# Altium schematic sheet Conector_FPGA.SchDoc
size A4
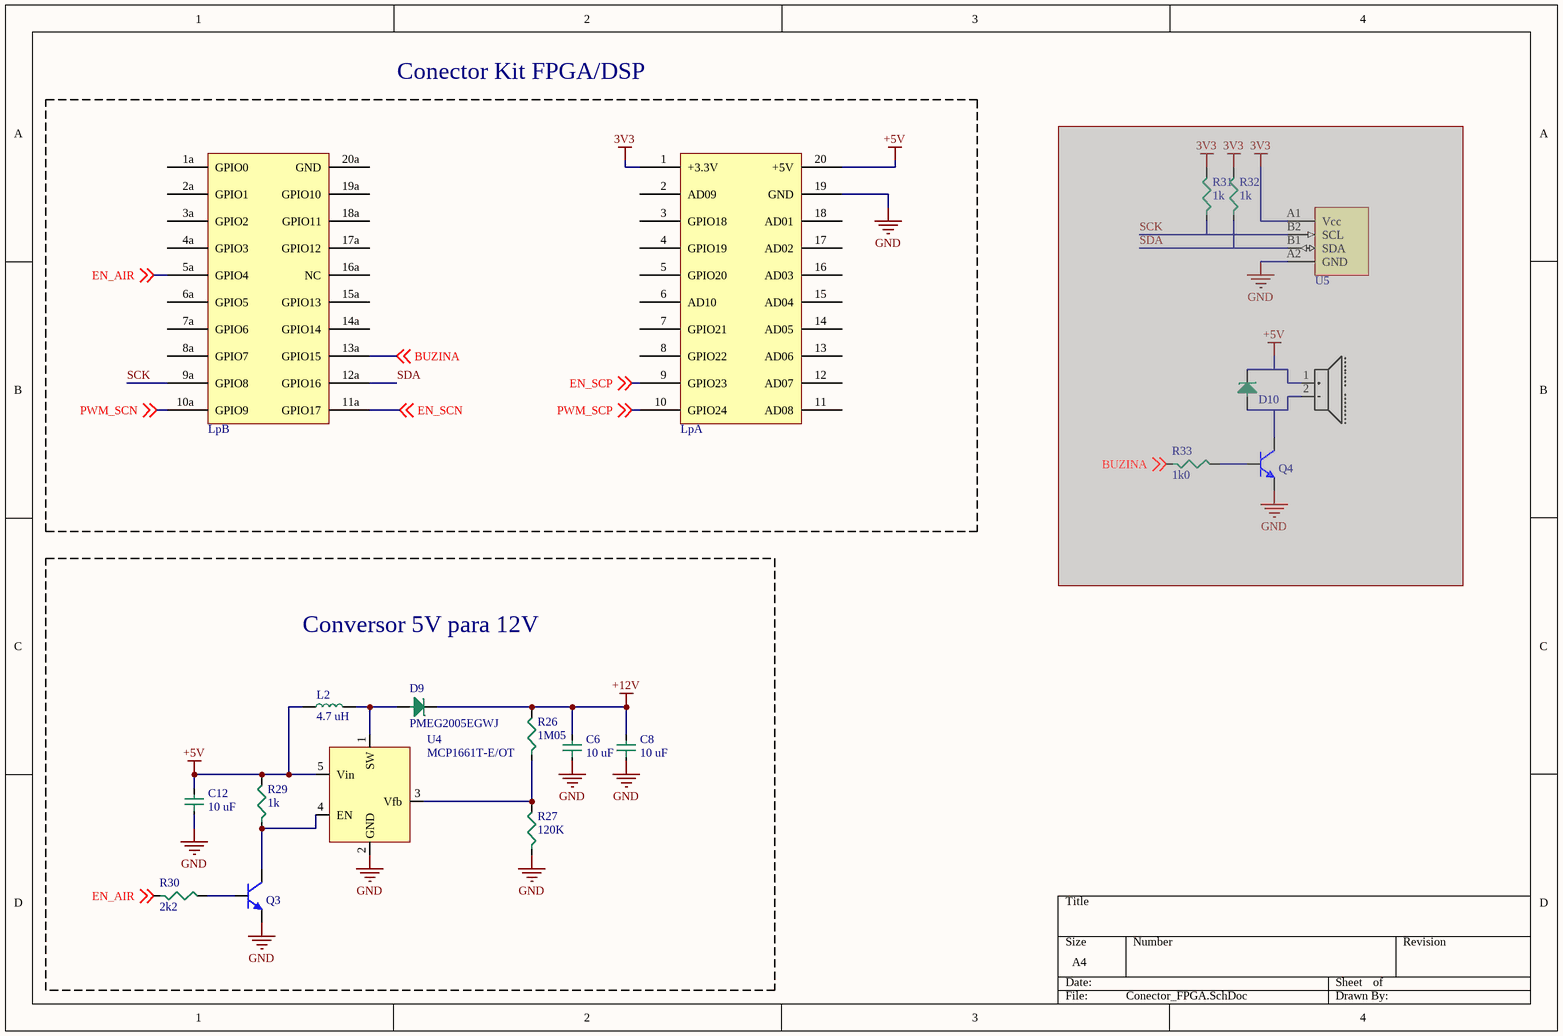
[diagram p0: Conector_FPGA.SchDoc]

## Parts
Bz1  CT-1205H-SMT-TR  [BUZZER_SMD]  (value not drawn)  (masked out: inside a compile mask, not in the netlist)
C6  value 10 uF  [0603C]  (hidden comment: 0603)
C8  value 10 uF  [0603C]  (hidden comment: 0603)
C12  value 10 uF  [0603C]  (hidden comment: 0603)
D9  PMEG2005EGWJ  [SOD-123-2]
D10  PMEG2005EGWJ  [SOD-123-2]  (value not drawn)  (masked out: inside a compile mask, not in the netlist)
L2  value 4.7 uH  [LPS5030]  (hidden comment: LPS5030-472MRB)
Lp  FPGAStartKit  [FPGA_BRUXILIS_SMD]  (value not drawn)  (parts A,B of 2)
Q3  BC-817-40  [SOT23-3N]  (value not drawn)
Q4  BC-817-40  [SOT23-3N]  (value not drawn)  (masked out: inside a compile mask, not in the netlist)
R26  value 1M05  [0603]  (hidden comment: 0603)
R27  value 120K  [0603]  (hidden comment: 0603)
R29  value 1k  [0603]  (hidden comment: 0603)
R30  value 2k2  [0603]  (hidden comment: 0603)
R31  value 1k  [0603]  (hidden comment: 0603)  (masked out: inside a compile mask, not in the netlist)
R32  value 1k  [0603]  (hidden comment: 0603)  (masked out: inside a compile mask, not in the netlist)
R33  value 1k0  [0603]  (hidden comment: 0603)  (masked out: inside a compile mask, not in the netlist)
U4  MCP1661T-E/OT  [SOT-23-5]
U5  AT30TS74-UFM14-T-072  [WLCSP-4]  (value not drawn)  (masked out: inside a compile mask, not in the netlist)

## Blocks framed on the sheet
Conector Kit FPGA/DSP: Lp
Conversor 5V para 12V: C6 C8 C12 D9 L2 Q3 R26 R27 R29 R30 U4

## Nets
3V3: Lp.1(+3.3V)
+5V: C12.2 L2.1 Lp.20(+5V) R29.2 U4.5(Vin)
+12V: C6.2 C8.2 D9.K R26.2
GND: C6.1 C8.1 C12.1 Lp.19(GND) Q3.2(E) R27.1 U4.2(GND)
BUZINA: Lp.13a(GPIO15) ; off-sheet BUZINA
EN_AIR: Lp.5a(GPIO4) R30.1 ; off-sheet EN_AIR
EN_SCN: Lp.11a(GPIO17) ; off-sheet EN_SCN
EN_SCP: Lp.9(GPIO23) ; off-sheet EN_SCP
PWM_SCN: Lp.10a(GPIO9) ; off-sheet PWM_SCN
PWM_SCP: Lp.10(GPIO24) ; off-sheet PWM_SCP
SCK: Lp.9a(GPIO8)
SDA: Lp.12a(GPIO16)
NetD9_A: D9.A L2.2 U4.1(SW)
NetQ3_1: Q3.1(B) R30.2
NetQ3_3: Q3.3(C) R29.1 U4.4(EN)
NetR26_1: R26.1 R27.2 U4.3(Vfb)

Not connected (* = marked no-connect by the designer): Lp 1a(GPIO0) 2(AD09) 2a(GPIO1) 3(GPIO18) 3a(GPIO2) 4(GPIO19) 4a(GPIO3) 5(GPIO20) 6(AD10) 6a(GPIO5) 7(GPIO21) 7a(GPIO6) 8(GPIO22) 8a(GPIO7) 11(AD08) 12(AD07) 13(AD06) 14(AD05) 14a(GPIO14) 15(AD04) 15a(GPIO13) 16(AD03) 16a(NC) 17(AD02) 17a(GPIO12) 18(AD01) 18a(GPIO11) 19a(GPIO10) 20a(GND)

## Library data of the parts
Bz1 = Buzzer SMD: Piezo Buzzers & Audio Indicators Buzzers; ComponentLink1Description: MOUSER; ComponentLink1URL: https://br.mouser.com/ProductDetail/490-CT-1205H-SMT-TR; ComponentLink2Description: DATASHEET; ComponentLink2URL: https://br.mouser.com/datasheet/2/670/ct-1205h-smt-tr-1777556.pdf
C6 C8 C12 = Capacitor SMD 0603
D9 D10 = Diodo Schottky PMEG2005: Schottky Diodes & Rectifiers SCHOTTKY DIODES; ComponentLink1Description: MOUSER; ComponentLink1URL: https://br.mouser.com/ProductDetail/841-PMEG2005EGWJ; ComponentLink2Description: DATASHEET; ComponentLink2URL: https://br.mouser.com/datasheet/2/916/PMEG6010CEGW-1599909.pdf
L2 = Indutor LPS5030-472MRB SMD: Fixed Inductors 4.7uH Shld 20% 2A 83mOhms; ComponentLink1Description: MOUSER; ComponentLink1URL: https://br.mouser.com/ProductDetail/994-LPS5030-472MRB; ComponentLink2Description: DATASHEET; ComponentLink2URL: https://br.mouser.com/datasheet/2/597/lps5030-270738.pdf
Lp = FPGAStart
Q3 Q4 = BC-817-40: NPN General Purpose Amplifier; Published: 8-Jun-2000; LatestRevisionDate: 15-Jan-2003; LatestRevisionNote: PCB Footprint 'BCY-W3/D4.7' replaced; DatasheetVersion: 1997; PackageVersion: Sep-1998; PackageReference: TO-92A; Publisher: Altium Limited; Code_JEDEC: TO-92A; ComponentLink1Description: Manufacturer Link; ComponentLink1URL: http://www.fairchildsemi.com/; ComponentLink2Description: Datasheet; ComponentLink2URL: http://www.fairchildsemi.com/ds/2N%2F2N3904.pdf
R26 R27 R29-R33 = Resistor SMD 0603 1/10 W: %: ±1%; P: 1/8W
U4 = MCP1661: Switching Voltage Regulators 32V Output Non-synch Boost Regulator; ComponentLink1Description: datasheet; ComponentLink1URL: https://br.mouser.com/datasheet/2/268/20005315A-357524.pdf; ComponentLink2Description: mouser; ComponentLink2URL: https://br.mouser.com/ProductDetail/579-MCP1661T-E-OT
U5 = Sensor Temperatura AT30TS74: Board Mount Temperature Sensors 4Ch, 1.7-5.5V, 3.4MHz, H-Tmp, 4-WLCSP; ComponentLink1Description: MOUSER; ComponentLink1URL: https://br.mouser.com/ProductDetail/556-T30TS74UFM14T072; ComponentLink2Description: DATASHEET; ComponentLink2URL: https://br.mouser.com/datasheet/2/268/Web_AT30TS74_0217-1509249.pdf